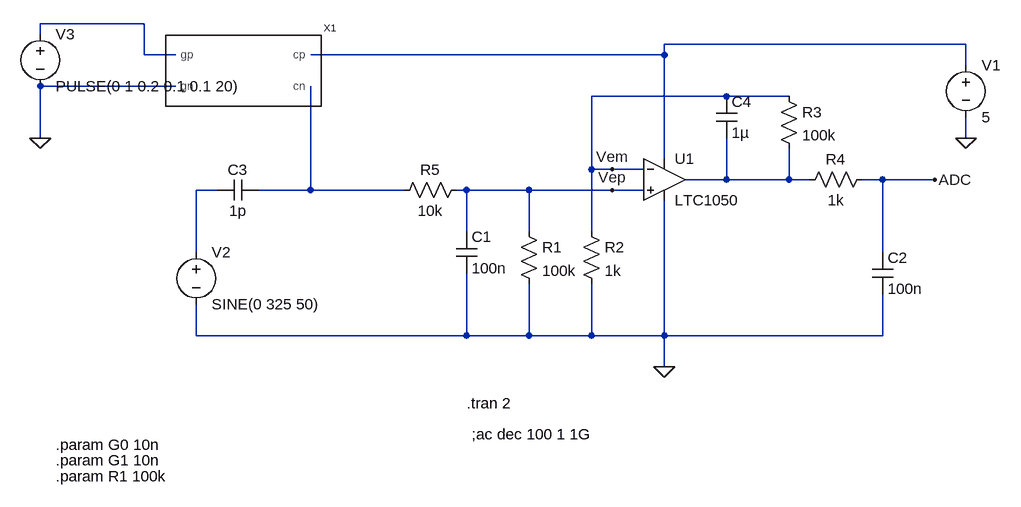
[diagram p0: schematic Capteur_graphite_complet.asc]
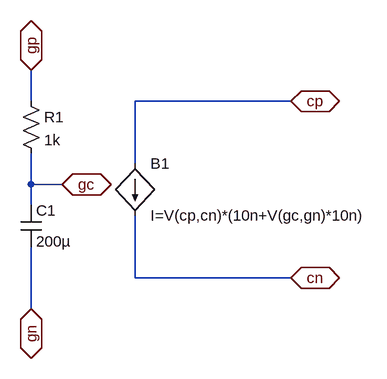
[diagram p1: sub-circuit capteur_graphite.asc]
Capteur_graphite_complet.asc, the LTspice schematic file:
Version 4
SHEET 1 880 680
WIRE -464 -448 -624 -448
WIRE -624 -432 -624 -448
WIRE 800 -416 336 -416
WIRE -464 -400 -464 -448
WIRE -416 -400 -464 -400
WIRE 336 -400 336 -416
WIRE 336 -400 -208 -400
WIRE 800 -384 800 -416
WIRE -416 -352 -624 -352
WIRE 432 -336 224 -336
WIRE 528 -336 432 -336
WIRE -624 -272 -624 -352
WIRE 800 -272 800 -304
WIRE 336 -240 336 -400
WIRE 224 -224 224 -336
WIRE 256 -224 224 -224
WIRE 304 -224 256 -224
WIRE 432 -208 432 -272
WIRE 432 -208 368 -208
WIRE 528 -208 528 -256
WIRE 528 -208 432 -208
WIRE 560 -208 528 -208
WIRE 672 -208 640 -208
WIRE 752 -208 672 -208
WIRE -352 -192 -384 -192
WIRE -208 -192 -208 -352
WIRE -208 -192 -288 -192
WIRE -64 -192 -208 -192
WIRE 32 -192 16 -192
WIRE 128 -192 32 -192
WIRE 256 -192 128 -192
WIRE 304 -192 256 -192
WIRE 32 -128 32 -192
WIRE 128 -128 128 -192
WIRE 224 -128 224 -224
WIRE -384 -96 -384 -192
WIRE 672 -96 672 -208
WIRE -384 32 -384 -16
WIRE 32 32 32 -64
WIRE 32 32 -384 32
WIRE 128 32 128 -48
WIRE 128 32 32 32
WIRE 224 32 224 -48
WIRE 224 32 128 32
WIRE 336 32 336 -176
WIRE 336 32 224 32
WIRE 672 32 672 -32
WIRE 672 32 336 32
WIRE 336 80 336 32
FLAG 336 80 0
FLAG 800 -272 0
FLAG 256 -224 Vem
FLAG 256 -192 Vep
FLAG 752 -208 ADC
FLAG -624 -272 0
SYMBOL res 112 -144 R0
SYMATTR InstName R1
SYMATTR Value 100k
SYMBOL res 208 -144 R0
SYMATTR InstName R2
SYMATTR Value 1k
SYMBOL cap 16 -128 R0
SYMATTR InstName C1
SYMATTR Value 100n
SYMBOL OpAmps\\LTC1050 336 -272 R0
SYMATTR InstName U1
SYMBOL cap 656 -96 R0
SYMATTR InstName C2
SYMATTR Value 100n
SYMBOL cap 416 -336 R0
SYMATTR InstName C4
SYMATTR Value 1µ
SYMBOL res 512 -352 R0
SYMATTR InstName R3
SYMATTR Value 100k
SYMBOL res 656 -224 R90
WINDOW 0 0 56 VBottom 2
WINDOW 3 32 56 VTop 2
SYMATTR InstName R4
SYMATTR Value 1k
SYMBOL res 32 -208 R90
WINDOW 0 0 56 VBottom 2
WINDOW 3 32 56 VTop 2
SYMATTR InstName R5
SYMATTR Value 10k
SYMBOL voltage 800 -400 R0
WINDOW 123 0 0 Left 0
WINDOW 39 0 0 Left 0
SYMATTR InstName V1
SYMATTR Value 5
SYMBOL Capteur_graphite -304 -384 R0
SYMATTR InstName X1
SYMBOL voltage -384 -112 R0
WINDOW 123 0 0 Left 0
WINDOW 39 0 0 Left 0
SYMATTR InstName V2
SYMATTR Value SINE(0 325 50)
SYMBOL voltage -624 -448 R0
WINDOW 123 0 0 Left 0
WINDOW 39 0 0 Left 0
SYMATTR InstName V3
SYMATTR Value PULSE(0 1 0.2 0.1 0.1 20)
SYMBOL cap -288 -208 R90
WINDOW 0 0 32 VBottom 2
WINDOW 3 32 32 VTop 2
SYMATTR InstName C3
SYMATTR Value 1p
TEXT 32 136 Left 2 !.tran 2
TEXT 40 184 Left 2 !;ac dec 100 1 1G
TEXT -600 200 Left 2 !.param G0 10n
TEXT -600 224 Left 2 !.param G1 10n
TEXT -600 248 Left 2 !.param R1 100k

capteur_graphite.asc, the sub-circuit schematic file:
Version 4
SHEET 1 880 680
WIRE -64 16 -64 -32
WIRE 336 16 96 16
WIRE 96 112 96 16
WIRE -64 144 -64 96
WIRE -16 144 -64 144
WIRE -64 176 -64 144
WIRE 96 288 96 192
WIRE 336 288 96 288
WIRE -64 336 -64 240
FLAG 336 16 cp
IOPIN 336 16 BiDir
FLAG 336 288 cn
IOPIN 336 288 BiDir
FLAG -64 336 gn
IOPIN -64 336 BiDir
FLAG -64 -32 gp
IOPIN -64 -32 BiDir
FLAG -16 144 gc
IOPIN -16 144 BiDir
SYMBOL bi 96 112 R0
SYMATTR InstName B1
SYMATTR Value I=V(cp,cn)*(10n+V(gc,gn)*10n)
SYMBOL res -80 0 R0
SYMATTR InstName R1
SYMATTR Value 1k
SYMBOL cap -80 176 R0
SYMATTR InstName C1
SYMATTR Value 200µ

The netlist it stands for:
* Capteur_graphite_complet.asc
R1 Vep 0 100k
R2 Vem 0 1k
C1 Vep 0 100n
XU1 Vep Vem N002 0 N003 LTC1050  ; pins In+ In- V+ V- OUT
C2 ADC 0 100n
C4 Vem N003 1µ
R3 Vem N003 100k
R4 ADC N003 1k
R5 Vep N005 10k
V1 N002 0 5
XX1 N002 N005 N001 0 capteur_graphite
V2 N004 0 SINE(0 325 50)
V3 N001 0 PULSE(0 1 0.2 0.1 0.1 20)
C3 N005 N004 1p

* block symbol definitions
.subckt capteur_graphite cp cn gp gn
B1 cp cn I=V(cp,cn)*(10n+V(gc,gn)*10n)
R1 gp gc 1k
C1 gc gn 200µ
.ends capteur_graphite

.tran 2
;ac dec 100 1 1G
.param G0 10n
.param G1 10n
.param R1 100k
.lib LTC.lib
.backanno
.end